# EAGLE design 2in-2out_1.0 (EAGLE 5.02)
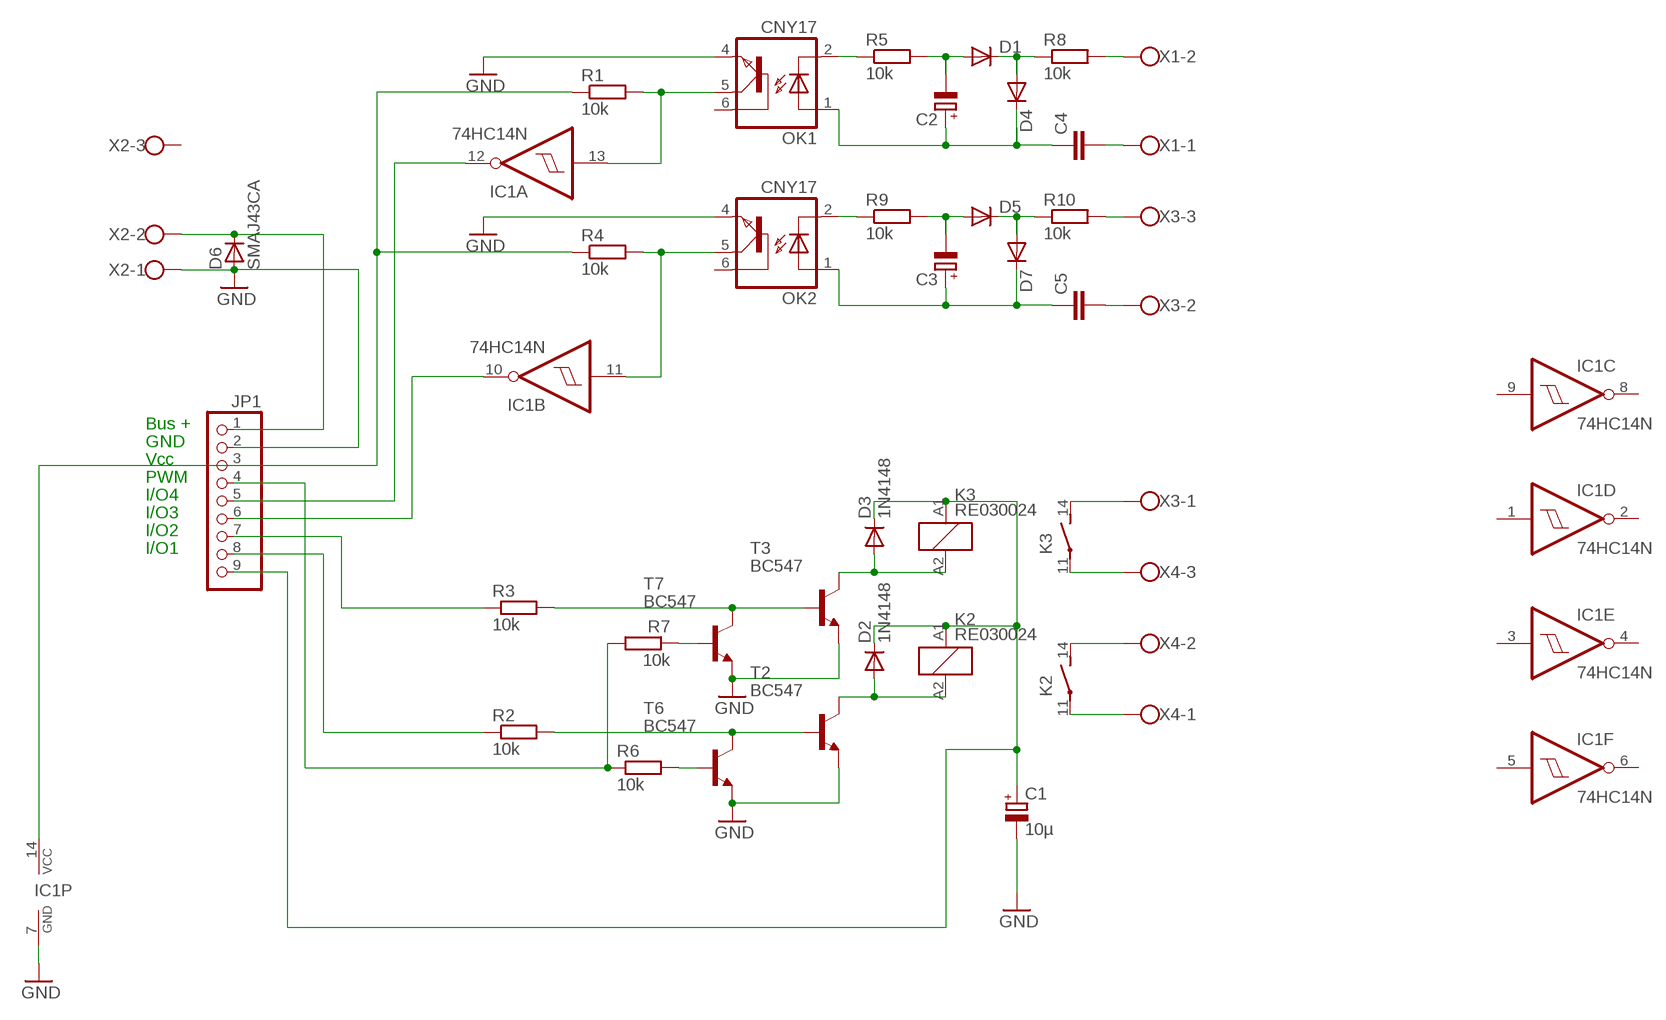
[diagram p0: schematic, sheet 1]

## Parts
C1  10µ  CPOL-EUE3.5-10  [E3,5-10]
C2  CPOL-EUE2-4  [E2-4]
C3  CPOL-EUE2-4  [E2-4]
C4  C-EU075-063X106  [C075-063X106]
C5  C-EU075-063X106  [C075-063X106]
D1  DIODE-D-2.5  [D-2.5]
D2  1N4148  1N4148STEHEND  [D-2.5]
D3  1N4148  1N4148STEHEND  [D-2.5]
D4  DIODE-D-2.5  [D-2.5]
D5  DIODE-D-2.5  [D-2.5]
D6  SMAJ43CA  D-SMB  [SMB]
D7  DIODE-D-2.5  [D-2.5]
IC1  74HC14N  [DIL14]
JP1  PINHD-1X9  [1X09]
K2  RE030024  [RE-SCHRACK]
K3  RE030024  [RE-SCHRACK]
OK1  CNY17  [DIL06]
OK2  CNY17  [DIL06]
R1  10k  R-EU_0207/2V  [0207/2V]
R2  10k  R-EU_0207/2V  [0207/2V]
R3  10k  R-EU_0207/2V  [0207/2V]
R4  10k  R-EU_0207/2V  [0207/2V]
R5  10k  R-EU_0207/2V  [0207/2V]
R6  10k  R-EU_0207/5V  [0207/5V]
R7  10k  R-EU_0207/5V  [0207/5V]
R8  10k  R-EU_0207/2V  [0207/2V]
R9  10k  R-EU_0207/2V  [0207/2V]
R10  10k  R-EU_0207/2V  [0207/2V]
T2  BC547  [TO92]
T3  BC547  [TO92]
T6  BC547  [TO92]
T7  BC547  [TO92]
X1  W237-02P  [W237-132]
X2  W237-3E  [W237-3E]
X3  W237-3E  [W237-3E]
X4  W237-3E  [W237-3E]

## Nets
GND: C1.- D6.2(A) IC1.7(P:GND) JP1.2 OK1.4(EMI) OK2.4(EMI) T2.1(E) T3.1(E) T6.1(E) T7.1(E) X2.1
IO1: JP1.8 R2.1
IO2: JP1.7 R3.1
IO3: IC1.10(B:O) JP1.6
IO4: IC1.12(A:O) JP1.5
N$1: OK1.2(C) R5.1
N$2: K3.14(2:S) X3.1
N$3: C2.- D1.A R5.2
N$4: D6.1(C) JP1.1 X2.2
N$5: D1.C D4.A R8.1
N$6: R8.2 X1.2
N$7: K3.11(2:P) X4.3
N$8: K2.14(2:S) X4.2
N$9: K2.11(2:P) X4.1
N$10: OK2.2(C) R9.1
N$11: R10.2 X3.3
N$12: JP1.4 R6.1 R7.2
N$13: C3.- D5.A R9.2
N$14: R3.2 T3.2(B) T7.3(C)
N$15: C4.2 X1.1
N$17: R2.2 T2.2(B) T6.3(C)
N$18: D5.C D7.A R10.1
N$19: D2.A K2.A2 T2.3(C)
N$20: C3.+ C5.1 D7.C OK2.1(A)
N$21: R7.1 T7.2(B)
N$22: R6.2 T6.2(B)
N$23: C5.2 X3.2
N$24: C2.+ C4.1 D4.C OK1.1(A)
N$28: IC1.11(B:I) OK2.5(COL) R4.2
N$29: IC1.13(A:I) OK1.5(COL) R1.2
N$30: IC1.14(P:VCC) JP1.3 R1.1 R4.1
R3: D3.A K3.A2 T3.3(C)
VDD_IN: C1.+ D2.C D3.C JP1.9 K2.A1 K3.A1
Unconnected: IC1.1(D:I) IC1.2(D:O) IC1.3(E:I) IC1.4(E:O) IC1.5(F:I) IC1.6(F:O) IC1.8(C:O) IC1.9(C:I) OK1.6(BAS) OK2.6(BAS) X2.3

## Notes on the sheet
- Bus +
- GND
- Vcc
- PWM
- I/O4
- I/O3
- I/O2
- I/O1

## Library data of the parts
C1-C3 = rcl:CPOL-EU: POLARIZED CAPACITOR, European symbol
C4 C5 = rcl:C-EU: CAPACITOR, European symbol
D1 D4 D5 D7 = diode:DIODE-: DIODE
D2 D3 = diode:1N4148: DIODE high speed (Philips)
D6 = semicon-smd-ipc:D-: DIODE unfilled
IC1 = 74xx-eu:74*14: Hex schmitt trigger INVERTER
JP1 = pinhead:PINHD-1X9: PIN HEADER
K2 K3 = relay:RE03*: Miniature PCB Relay 1 pole 6 A SCHRACK Source: http://www.schrack.com/.. 5812.pdf
OK1 OK2 = optocoupler:CNY17: SIEMENS OPTO COUPLER
R1-R10 = rcl:R-EU_: RESISTOR, European symbol
T2 T3 T6 T7 = transistor-npn:BC547*: NPN Transistor
X1 = con-wago-508:W237-02P: WAGO SREW CLAMP
X2-X4 = con-wago-508:W237-3E: WAGO SREW CLAMP

## Board
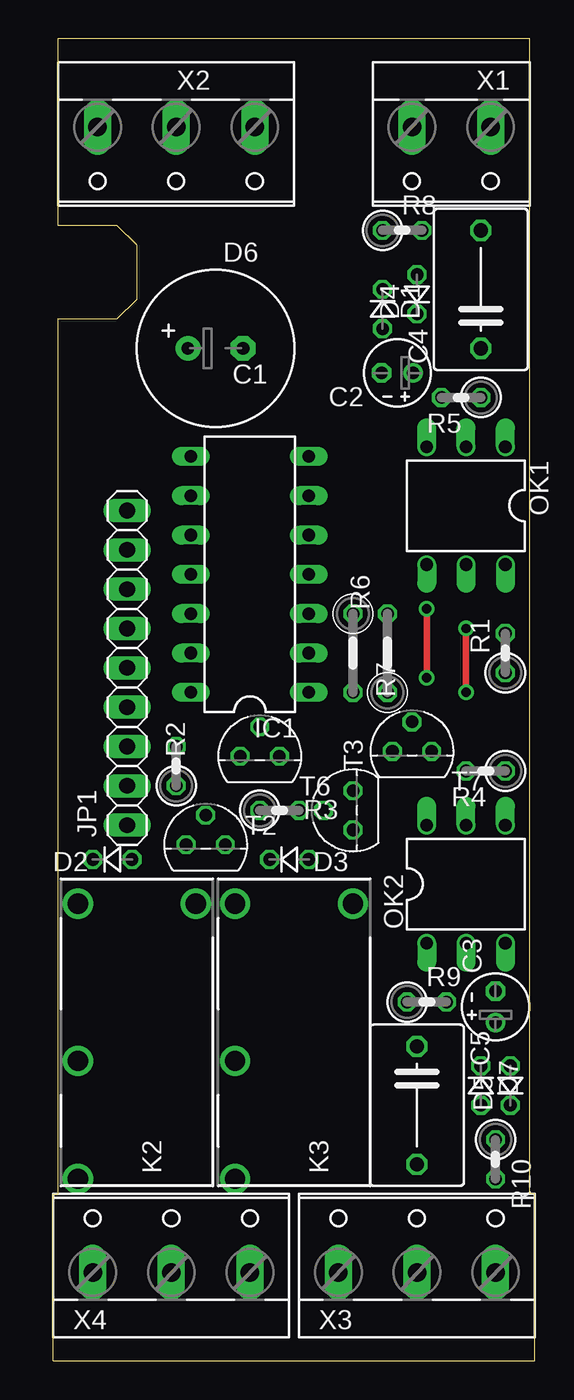
[diagram p1: board, top side]
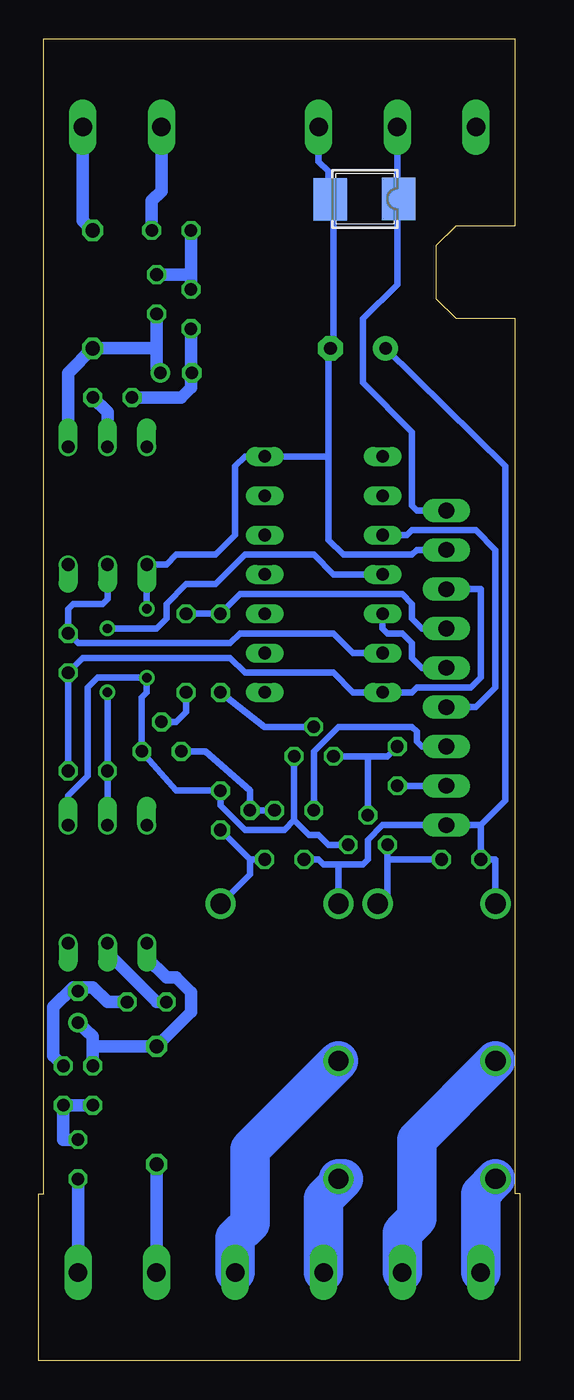
[diagram p2: board, bottom side, seen from below]

Size 31.11 x 85.41 mm. Coordinates in mm from the lower left corner, seen from the top.
Outline: 0,0 0,10.79 0.32,10.79 0.32,67.31 4.13,67.31 5.4,68.58 5.4,72.07 4.13,73.34 0.32,73.34 0.32,85.41 30.8,85.41 30.8,10.79 31.11,10.79 31.11,0 0,0
Copper layers (1*16): Top 0.035mm / dielectric 1.5mm / Bottom 0.035mm
Design rules "ZWILLING": minimum track width 0.2mm, minimum drill 0.5mm, track to track 0.2mm, track to pad 0.2mm, pad to pad 0.2mm, via to via 0.2mm, smd to smd 0mil, copper to edge 0.2mm, drill to drill 0.2mm, minimum pad ring 0.2mm, minimum via ring 0.2mm, stop-mask expansion 0.1mm, vias tented up to drill 0mil, thermal gap 10mil

### Footprints (pad centres in the part's own frame; a part is rotated, then mirrored left to right if it is on the bottom)
E3,5-10 = drill 0.813 pad 1.6 round: + -1.778,0 | drill 0.813 pad 1.6 octagon: - 1.778,0
E2-4 = drill 0.813 pad 1.27 round: + -1.016,0 | drill 0.813 pad 1.27 octagon: - 1.016,0
C075-063X106 = drill 0.914 octagon: 1 -3.81,0; 2 3.81,0
D-2.5 = drill 0.813 octagon: A 1.27,0; C -1.27,0
SMB = smd 2.159 x 2.743: 1 -2.311,-0.127; 2 2.108,-0.102
DIL14 = drill 0.813 long: 1 -7.62,-3.81; 2 -5.08,-3.81; 3 -2.54,-3.81; 4 0,-3.81; 5 2.54,-3.81; 6 5.08,-3.81; 7 7.62,-3.81; 8 7.62,3.81; 9 5.08,3.81; 10 2.54,3.81; 11 0,3.81; 12 -2.54,3.81; 13 -5.08,3.81; 14 -7.62,3.81
1X09 = drill 1.016 long: 1 -10.16,0; 2 -7.62,0; 3 -5.08,0; 4 -2.54,0; 5 0,0; 6 2.54,0; 7 5.08,0; 8 7.62,0; 9 10.16,0
RE-SCHRACK = drill 1.3 round: 11 8.89,-3.81; 14 1.27,-3.81; A1 -8.89,-3.81; A2 -8.89,3.81
DIL06 = drill 0.813 offset: 1 -2.54,-3.81; 2 0,-3.81; 3 2.54,-3.81; 4 2.54,3.81; 5 0,3.81; 6 -2.54,3.81
0207/2V = drill 0.813 octagon: 1 -1.27,0; 2 1.27,0
0207/5V = drill 0.813 octagon: 1 -2.54,0; 2 2.54,0
TO92 = drill 0.813 octagon: 1 1.27,0; 2 0,1.905; 3 -1.27,0
W237-132 = drill 1.194 long: 1 -2.54,-0.635; 2 2.54,-0.635
W237-3E = drill 1.194 long: 1 -5.08,-0.635; 2 0,-0.635; 3 5.08,-0.635

### Placement (x,y rotation side)
C1  10.48,65.41 0 top
C2  22.22,63.82 180 top
C3  28.57,22.86 90 top
C4  27.62,69.22 90 top
C5  23.49,16.51 270 top
D1  21.27,67.94 270 top
D2  3.81,32.38 0 top
D3  15.24,32.38 0 top
D4  23.49,68.9 90 top
D5  29.53,17.78 90 top
D6  10.16,74.93 180 bottom
D7  27.62,17.78 270 top
IC1  12.7,50.8 90 top
JP1  4.76,44.77 270 top
K2  5.4,20.64 270 top
K3  15.56,20.64 270 top
OK1  26.67,55.24 180 top
OK2  26.67,30.8 0 top
R1  29.21,45.72 90 top
R2  7.94,38.42 90 top
R3  14.61,35.56 0 top
R4  27.94,38.1 180 top
R5  26.35,62.23 180 top
R6  19.37,45.72 270 top
R7  21.59,45.72 90 top
R8  22.54,73.03 0 top
R9  24.13,23.18 0 top
R10  28.57,13.02 270 top
T2  9.84,33.34 0 top
T3  19.37,35.56 90 top
T6  13.34,39.05 0 top
T7  23.18,39.37 0 top
X1  25.72,79.06 180 top
X2  7.94,79.06 180 top
X3  23.49,6.35 0 top
X4  7.62,6.35 0 top

### Tracks (layer width: path | path; a pad name or v marks a point on that pad's centre or on a via)
GND  (via drill 0.6)
  Top 0.406: v24.13,44.13 v24.13,48.58
  Bottom 0.406: 14.6,34.92 T6.1 | 14.6,34.92 13.65,33.97 13.02,33.97 12.38,33.34 T2.1 | OK2.4 29.21,36.51 27.94,37.78 27.94,43.5 27.31,44.13 v24.13,44.13 24.13,43.18 24.45,42.86 T7.1 22.22,36.83 T3.1 19.37,35.88 17.78,34.29 15.24,34.29 14.6,34.92 | 12.38,58.42 IC1.7 17.78,58.42 18.42,57.78 18.42,53.34 19.68,52.07 22.22,52.07 22.86,51.44 OK1.4 v24.13,48.58 | 12.38,58.42 12.38,65.41 C1.- 12.07,65.41 12.07,75.03 D6.2 12.38,75.03 12.38,76.83 13.02,77.47 X2.1 | JP1.2 6.67,52.39 6.99,52.07 11.43,52.07 12.38,53.02 12.38,58.42
IO1
  Bottom 0.406: JP1.8 R2.1
IO2
  Bottom 0.406: R3.1 13.34,39.37 11.75,40.96 6.99,40.96 6.67,40.64 6.67,40.01 6.35,39.69 JP1.7
IO3
  Bottom 0.406: IC1.10 7.3,53.34 6.99,53.66 2.86,53.66 1.59,52.39 1.59,43.5 2.86,42.23 JP1.6
IO4
  Bottom 0.406: IC1.12 8.89,47.31 8.57,46.99 7.62,46.99 6.99,46.35 6.99,45.4 6.35,44.77 JP1.5
N$1
  Bottom 0.813: OK1.2 26.67,61.28 R5.1
N$2
  Bottom 2.54: X3.1 18.42,7.94 17.46,8.89 17.46,13.65 K3.14
N$3
  Bottom 0.406: 21.27,63.82 C2.-
  Bottom 0.813: R5.2 21.91,62.23 21.27,62.87 21.27,63.82 D1.A
N$4
  Bottom 0.406: JP1.1 6.67,54.93 6.99,55.24 6.99,60.01 10.16,63.18 10.16,67.31 7.94,69.53 7.94,75.06 | 7.94,75.06 7.94,75.25 | 7.94,75.06 D6.1 | 7.94,75.06 X2.2
N$5
  Bottom 0.813: R8.1 D1.C 21.27,70.17 D4.A
N$6
  Bottom 0.813: R8.2 23.81,74.93 23.18,75.56 X1.2
N$7
  Bottom 2.54: K3.11 11.43,11.75 12.7,10.48 X4.3
N$8
  Bottom 2.54: X4.2 7.62,8.26 6.67,9.21 6.67,14.29 K2.14
N$9
  Bottom 2.54: X4.1 2.54,10.79 K2.11
N$10
  Bottom 0.813: R9.1 23.49,23.18 26.67,26.35 OK2.2
N$11
  Bottom 0.813: X3.3 R10.2
N$12
  Bottom 0.406: R7.2 R6.1 18.1,49.53 7.62,49.53 6.99,48.9 6.99,47.94 6.35,47.31 JP1.4
N$13
  Bottom 0.406: 28.89,24.13 C3.-
  Bottom 0.813: D5.A 30.16,19.68 30.16,22.86 28.89,24.13 27.62,24.13 26.67,23.18 R9.2
N$14
  Bottom 0.406: R3.2 T3.2 17.46,36.83 20.32,39.37 T7.3
N$15
  Bottom 0.813: C4.2 28.26,73.66 X1.1
N$17
  Bottom 0.406: R2.2 8.57,39.05 9.84,39.05 | 9.84,39.05 T6.3 | T2.2 9.84,39.05
N$18
  Bottom 0.813: D7.A D5.C 29.53,14.29 R10.1
N$19
  Bottom 0.406: D2.A 8.57,32.38 | 8.57,32.38 T2.3 | K2.A2 8.57,29.53 8.57,32.38
N$20
  Bottom 0.813: 27.62,20.32 D7.C | 27.62,20.32 27.62,20.95 C3.+ | 27.62,20.32 C5.1 21.27,22.54 21.27,23.81 22.22,24.77 22.86,24.77 24.13,26.04 OK2.1
N$21
  Bottom 0.406: T7.2 22.22,41.27 21.59,41.91 R7.1
N$22
  Bottom 0.406: T6.2 16.51,40.96 R6.2
N$23
  Bottom 0.813: X3.2 C5.2
N$24
  Bottom 0.813: C2.+ 23.49,64.14 23.49,65.41 | 23.49,65.41 D4.C | 23.49,65.41 C4.1 29.21,63.82 OK1.1
N$28  (via drill 0.6)
  Top 0.406: v26.67,47.31 v26.67,43.18
  Bottom 0.406: OK2.5 R4.2 v26.67,43.18 | IC1.11 12.07,50.8 13.34,52.07 17.78,52.07 19.68,50.16 21.59,50.16 22.86,48.9 22.86,47.94 23.49,47.31 v26.67,47.31
N$29
  Bottom 0.406: IC1.13 10.79,45.72 12.07,46.99 18.1,46.99 18.73,46.35 28.58,46.35 R1.2 29.21,48.58 28.89,48.9 26.99,48.9 26.67,49.21 OK1.5
N$30
  Bottom 0.406: JP1.3 2.54,49.85 2.54,44.13 3.17,43.5 6.67,43.5 6.99,43.18 IC1.14 10.79,43.18 12.07,44.45 17.78,44.45 18.73,45.4 28.26,45.4 R1.1 R4.1
R3
  Bottom 0.406: 17.46,32.38 17.46,31.43 K3.A2 | D3.A 17.46,32.38 | 17.46,32.38 T3.3
VDD_IN
  Bottom 0.406: K2.A1 1.59,32.38 D2.C 2.54,34.61 | 2.54,34.61 JP1.9 8.89,34.61 9.84,33.66 9.84,32.38 10.16,32.07 11.75,32.07 | 11.75,32.07 K3.A1 | D3.C 13.02,32.38 12.7,32.07 11.75,32.07 | C1.+ 0.95,57.78 0.95,36.2 2.54,34.61